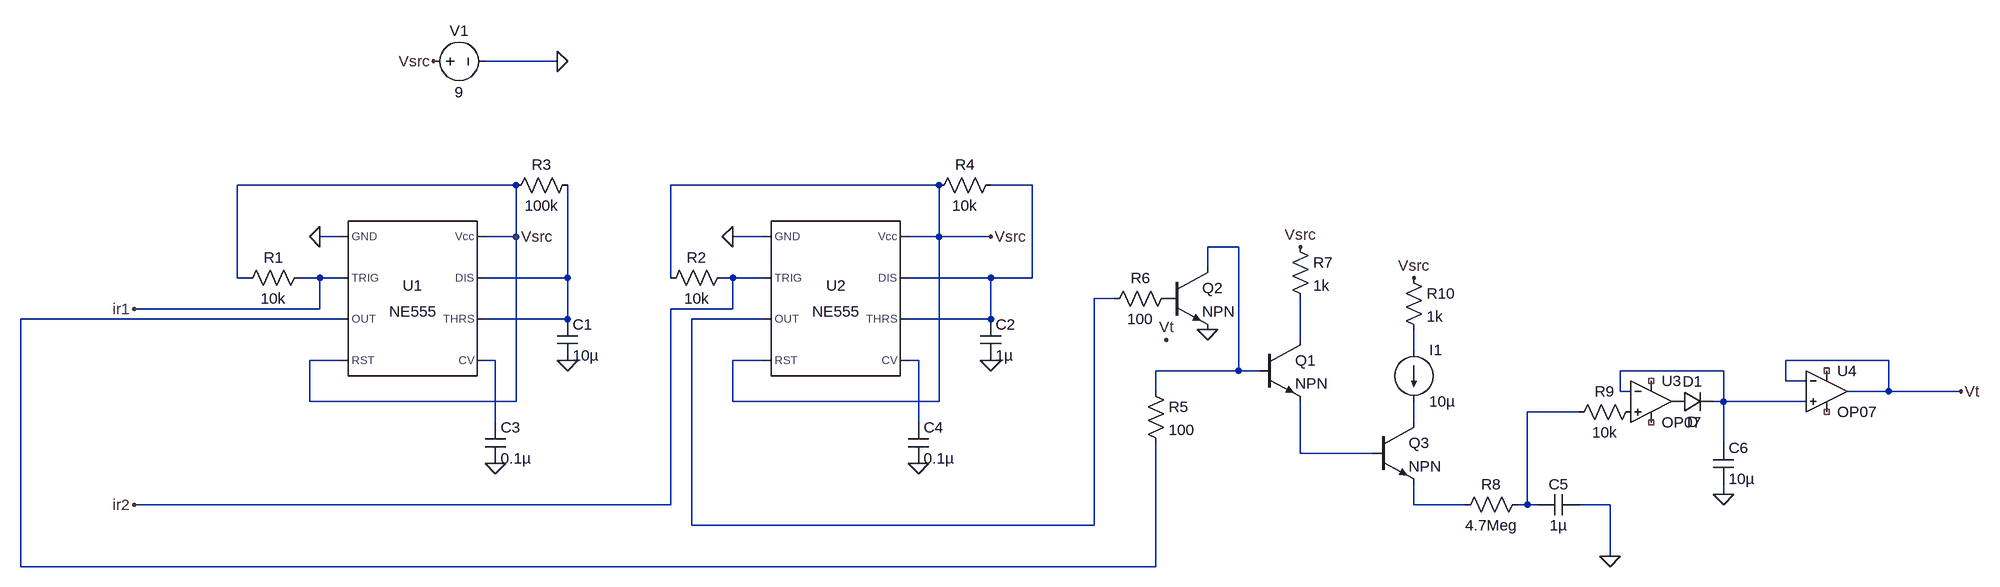
[diagram p0: schematic NEw.asc]
NEw.asc, the LTspice schematic file:
Version 4.1
SHEET 1 2756 680
WIRE 304 -240 192 -240
WIRE 240 -48 -192 -48
WIRE 896 -48 480 -48
WIRE 1040 -48 976 -48
WIRE -32 32 -64 32
WIRE 240 32 240 -48
WIRE 240 32 192 32
WIRE 624 32 576 32
WIRE 896 32 896 -48
WIRE 896 32 848 32
WIRE 976 32 896 32
WIRE 1360 48 1312 48
WIRE 1312 80 1312 48
WIRE -192 96 -192 -48
WIRE -176 96 -192 96
WIRE -64 96 -96 96
WIRE -32 96 -64 96
WIRE 320 96 320 -48
WIRE 320 96 192 96
WIRE 480 96 480 -48
WIRE 576 96 560 96
WIRE 624 96 576 96
WIRE 976 96 848 96
WIRE 1040 96 1040 -48
WIRE 1040 96 976 96
WIRE 1168 128 1136 128
WIRE -64 144 -64 96
WIRE -64 144 -352 144
WIRE 576 144 576 96
WIRE 576 144 480 144
WIRE -32 160 -528 160
WIRE 320 160 320 96
WIRE 320 160 192 160
WIRE 624 160 512 160
WIRE 976 160 976 96
WIRE 976 160 848 160
WIRE 1456 192 1456 128
WIRE 1632 208 1632 176
WIRE -32 224 -80 224
WIRE 208 224 192 224
WIRE 624 224 576 224
WIRE 864 224 848 224
WIRE 2368 224 2208 224
WIRE 1360 240 1360 48
WIRE 1360 240 1232 240
WIRE 1392 240 1360 240
WIRE 2112 240 1952 240
WIRE 2208 256 2208 224
WIRE 2240 256 2208 256
WIRE 1232 272 1232 240
WIRE 1952 272 1952 240
WIRE 1968 272 1952 272
WIRE 2368 272 2368 224
WIRE 2368 272 2304 272
WIRE 2480 272 2368 272
WIRE -80 288 -80 224
WIRE 240 288 240 32
WIRE 240 288 -80 288
WIRE 576 288 576 224
WIRE 896 288 896 32
WIRE 896 288 576 288
WIRE 2112 288 2112 240
WIRE 2112 288 2096 288
WIRE 2240 288 2112 288
WIRE 1888 304 1808 304
WIRE 208 320 208 224
WIRE 864 320 864 224
WIRE 1632 320 1632 288
WIRE 2112 352 2112 288
WIRE 1456 368 1456 288
WIRE 1568 368 1456 368
WIRE 2112 432 2112 416
WIRE 480 448 480 144
WIRE 480 448 -352 448
WIRE 1632 448 1632 416
WIRE 1712 448 1632 448
WIRE 1808 448 1808 304
WIRE 1808 448 1792 448
WIRE 1824 448 1808 448
WIRE 1936 448 1888 448
WIRE 512 480 512 160
WIRE 1136 480 1136 128
WIRE 1136 480 512 480
WIRE 1936 528 1936 448
WIRE -528 544 -528 160
WIRE 1232 544 1232 352
WIRE 1232 544 -528 544
FLAG 112 -240 Vsrc
FLAG 304 -240 0
FLAG 976 32 Vsrc
FLAG 240 32 Vsrc
FLAG -352 144 ir1
FLAG -352 448 ir2
FLAG 320 224 0
FLAG 976 224 0
FLAG 208 384 0
FLAG 864 384 0
FLAG -64 32 0
FLAG 576 32 0
FLAG 1312 176 0
FLAG 1456 48 Vsrc
FLAG 1936 528 0
FLAG 2112 432 0
FLAG 2480 272 Vt
FLAG 1248 192 Vt
FLAG 1632 96 Vsrc
SYMBOL Misc\\NE555 80 128 R0
SYMATTR InstName U1
SYMBOL Misc\\NE555 736 128 R0
SYMATTR InstName U2
SYMBOL voltage 96 -240 R270
WINDOW 0 32 56 VTop 2
WINDOW 3 -32 56 VBottom 2
WINDOW 123 0 0 Left 0
WINDOW 39 0 0 Left 0
SYMATTR InstName V1
SYMATTR Value 9
SYMBOL res -80 80 R90
WINDOW 0 0 56 VBottom 2
WINDOW 3 32 56 VTop 2
SYMATTR InstName R1
SYMATTR Value 10k
SYMBOL res 576 80 R90
WINDOW 0 0 56 VBottom 2
WINDOW 3 32 56 VTop 2
SYMATTR InstName R2
SYMATTR Value 10k
SYMBOL res 336 -64 R90
WINDOW 0 0 56 VBottom 2
WINDOW 3 32 56 VTop 2
SYMATTR InstName R3
SYMATTR Value 100k
SYMBOL cap 304 160 R0
SYMATTR InstName C1
SYMATTR Value 10µ
SYMBOL res 992 -64 R90
WINDOW 0 0 56 VBottom 2
WINDOW 3 32 56 VTop 2
SYMATTR InstName R4
SYMATTR Value 10k
SYMBOL cap 960 160 R0
SYMATTR InstName C2
SYMATTR Value 1µ
SYMBOL cap 192 320 R0
SYMATTR InstName C3
SYMATTR Value 0.1µ
SYMBOL cap 848 320 R0
SYMATTR InstName C4
SYMATTR Value 0.1µ
SYMBOL res 1216 256 R0
SYMATTR InstName R5
SYMATTR Value 100
SYMBOL npn 1392 192 R0
SYMATTR InstName Q1
SYMBOL res 1264 112 R90
WINDOW 0 0 56 VBottom 2
WINDOW 3 32 56 VTop 2
SYMATTR InstName R6
SYMATTR Value 100
SYMBOL npn 1248 80 R0
SYMATTR InstName Q2
SYMBOL res 1440 32 R0
SYMATTR InstName R7
SYMATTR Value 1k
SYMBOL npn 1568 320 R0
SYMATTR InstName Q3
SYMBOL res 1808 432 R90
WINDOW 0 0 56 VBottom 2
WINDOW 3 32 56 VTop 2
SYMATTR InstName R8
SYMATTR Value 4.7Meg
SYMBOL cap 1888 432 R90
WINDOW 0 0 32 VBottom 2
WINDOW 3 32 32 VTop 2
SYMATTR InstName C5
SYMATTR Value 1µ
SYMBOL res 1984 288 R90
WINDOW 0 0 56 VBottom 2
WINDOW 3 32 56 VTop 2
SYMATTR InstName R9
SYMATTR Value 10k
SYMBOL OpAmps\\OP07 2000 224 R0
SYMATTR InstName U3
SYMBOL diode 2032 304 R270
WINDOW 0 32 32 VTop 2
WINDOW 3 0 32 VBottom 2
SYMATTR InstName D1
SYMBOL cap 2096 352 R0
SYMATTR InstName C6
SYMATTR Value 10µ
SYMBOL OpAmps\\OP07 2272 208 R0
SYMATTR InstName U4
SYMBOL current 1632 208 R0
WINDOW 123 0 0 Left 0
WINDOW 39 0 0 Left 0
SYMATTR InstName I1
SYMATTR Value 10µ
SYMBOL res 1616 80 R0
SYMATTR InstName R10
SYMATTR Value 1k

The netlist it stands for:
* NEw.asc
X§U1 0 ir1 N005 Vsrc N008 N003 N003 Vsrc NE555  ; pins GND TRIG OUT RST CV THRS DIS Vcc
X§U2 0 ir2 N004 Vsrc N009 N001 N001 Vsrc NE555  ; pins GND TRIG OUT RST CV THRS DIS Vcc
V1 Vsrc 0 9
R1 ir1 Vsrc 10k
R2 ir2 Vsrc 10k
R3 N003 Vsrc 100k
C1 N003 0 10µ
R4 N001 Vsrc 10k
C2 N001 0 1µ
C3 N008 0 0.1µ
C4 N009 0 0.1µ
R5 N002 N005 100
Q1 N006 N002 N013 0 NPN
R6 P001 N004 100
Q2 N002 P001 0 0 NPN
R7 Vsrc N006 1k
Q3 N012 N013 N014 0 NPN
R8 N011 N014 4.7Meg
C5 0 N011 1µ
R9 P002 N011 10k
X§U3 P002 N010 NC_01 NC_02 P003 LT1001  ; OP07, pins In+ In- V+ V- OUT
D1 P003 N010 D
C6 N010 0 10µ
X§U4 N010 Vt NC_03 NC_04 Vt LT1001  ; OP07, pins In+ In- V+ V- OUT
I1 N007 N012 10µ
R10 Vsrc N007 1k
.model D D
.lib standard.dio
.model NPN NPN
.model PNP PNP
.lib standard.bjt
.lib NE555.sub
.lib LTC.lib
.backanno
.end